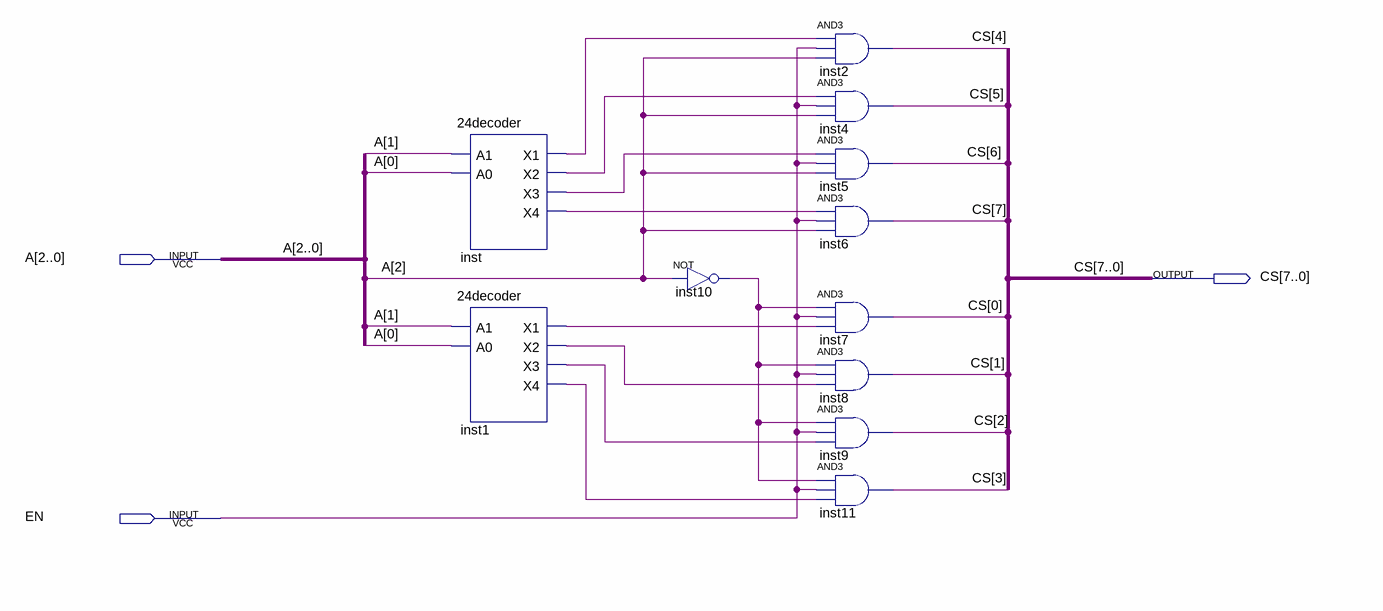
[diagram p0: schematic sheet]
// Quartus schematic 38decoder.bdf as structural Verilog: 11 symbols, 3 pins
module \38decoder  (
  input  [2:0] A,
  input  EN,
  output [7:0] CS
);

  wire inst1_x1, inst1_x2, inst1_x3, inst1_x4, inst10_out, inst_x1, inst_x2, inst_x3, inst_x4;

  \24decoder  inst (.A1(A[1]), .A0(A[0]), .X1(inst_x1), .X2(inst_x2), .X3(inst_x3), .X4(inst_x4));
  \24decoder  inst1 (.A1(A[1]), .A0(A[0]), .X1(inst1_x1), .X2(inst1_x2), .X3(inst1_x3), .X4(inst1_x4));
  not inst10 (inst10_out, A[2]);
  and inst2 (CS[4], inst_x1, EN, A[2]);
  and inst4 (CS[5], inst_x2, EN, A[2]);
  and inst5 (CS[6], inst_x3, EN, A[2]);
  and inst6 (CS[7], inst_x4, EN, A[2]);
  and inst7 (CS[0], inst10_out, EN, inst1_x1);
  and inst8 (CS[1], inst10_out, EN, inst1_x2);
  and inst9 (CS[2], inst10_out, EN, inst1_x3);
  and inst11 (CS[3], inst10_out, EN, inst1_x4);
endmodule
